# EAGLE design RoboatCore (EAGLE 7.7.0)
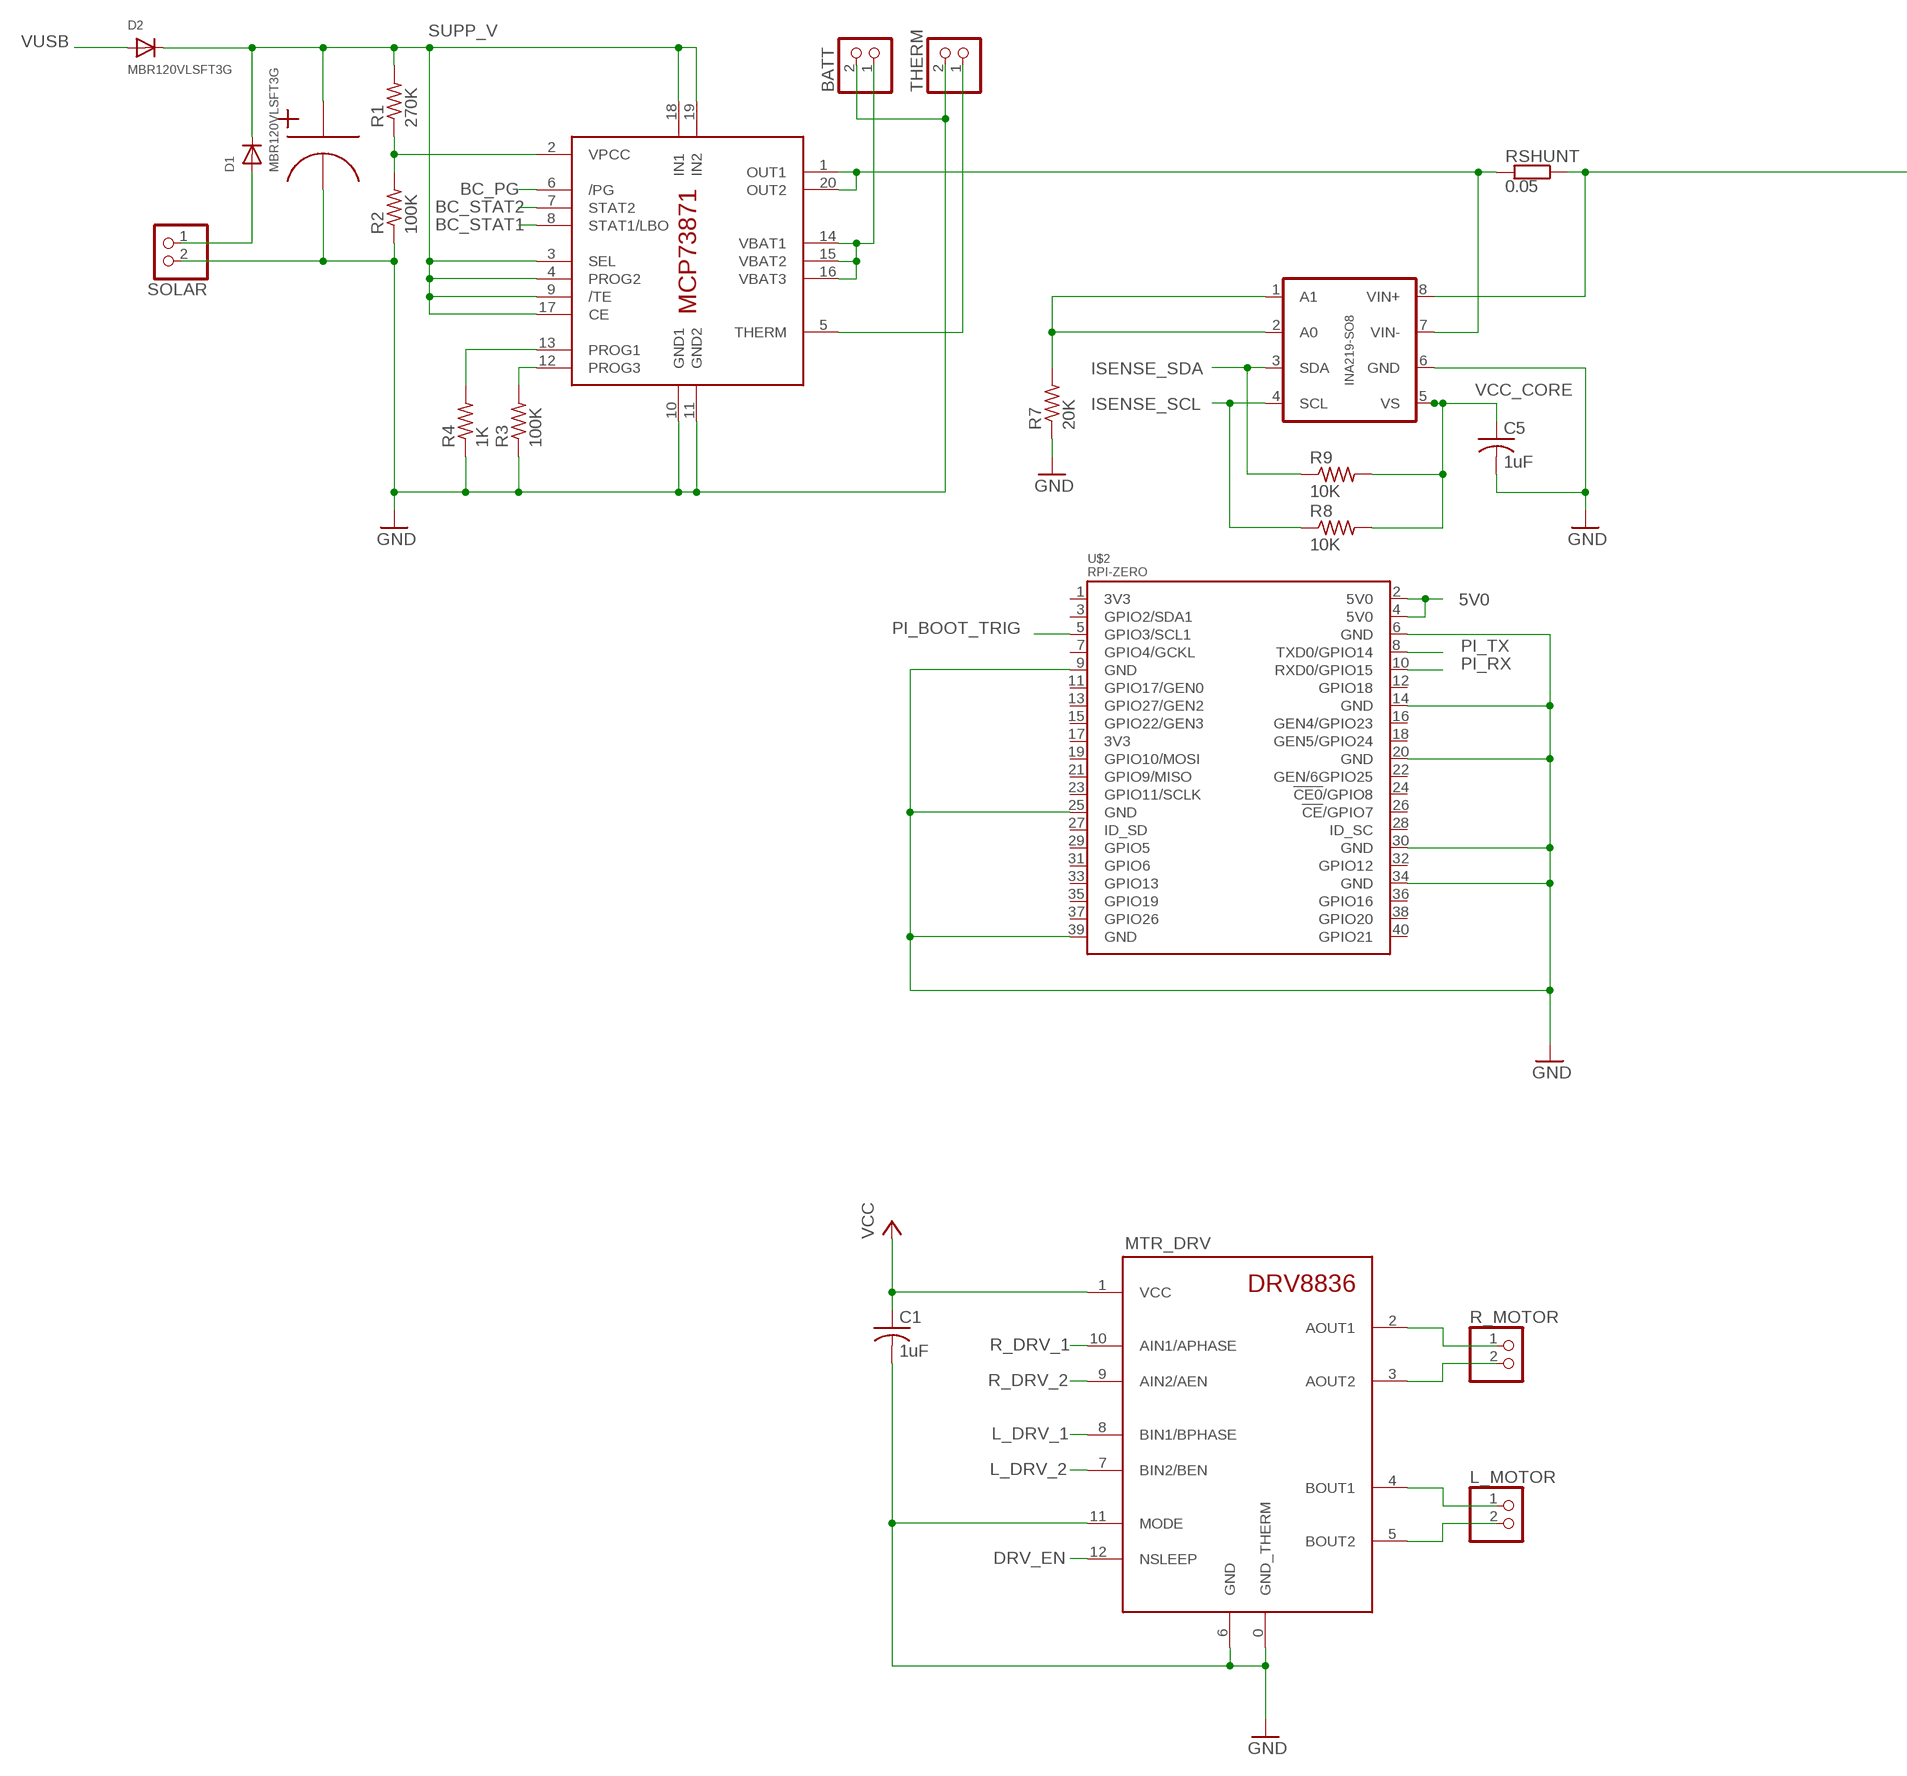
[diagram p0: schematic, sheet 1, part 1 of 2]
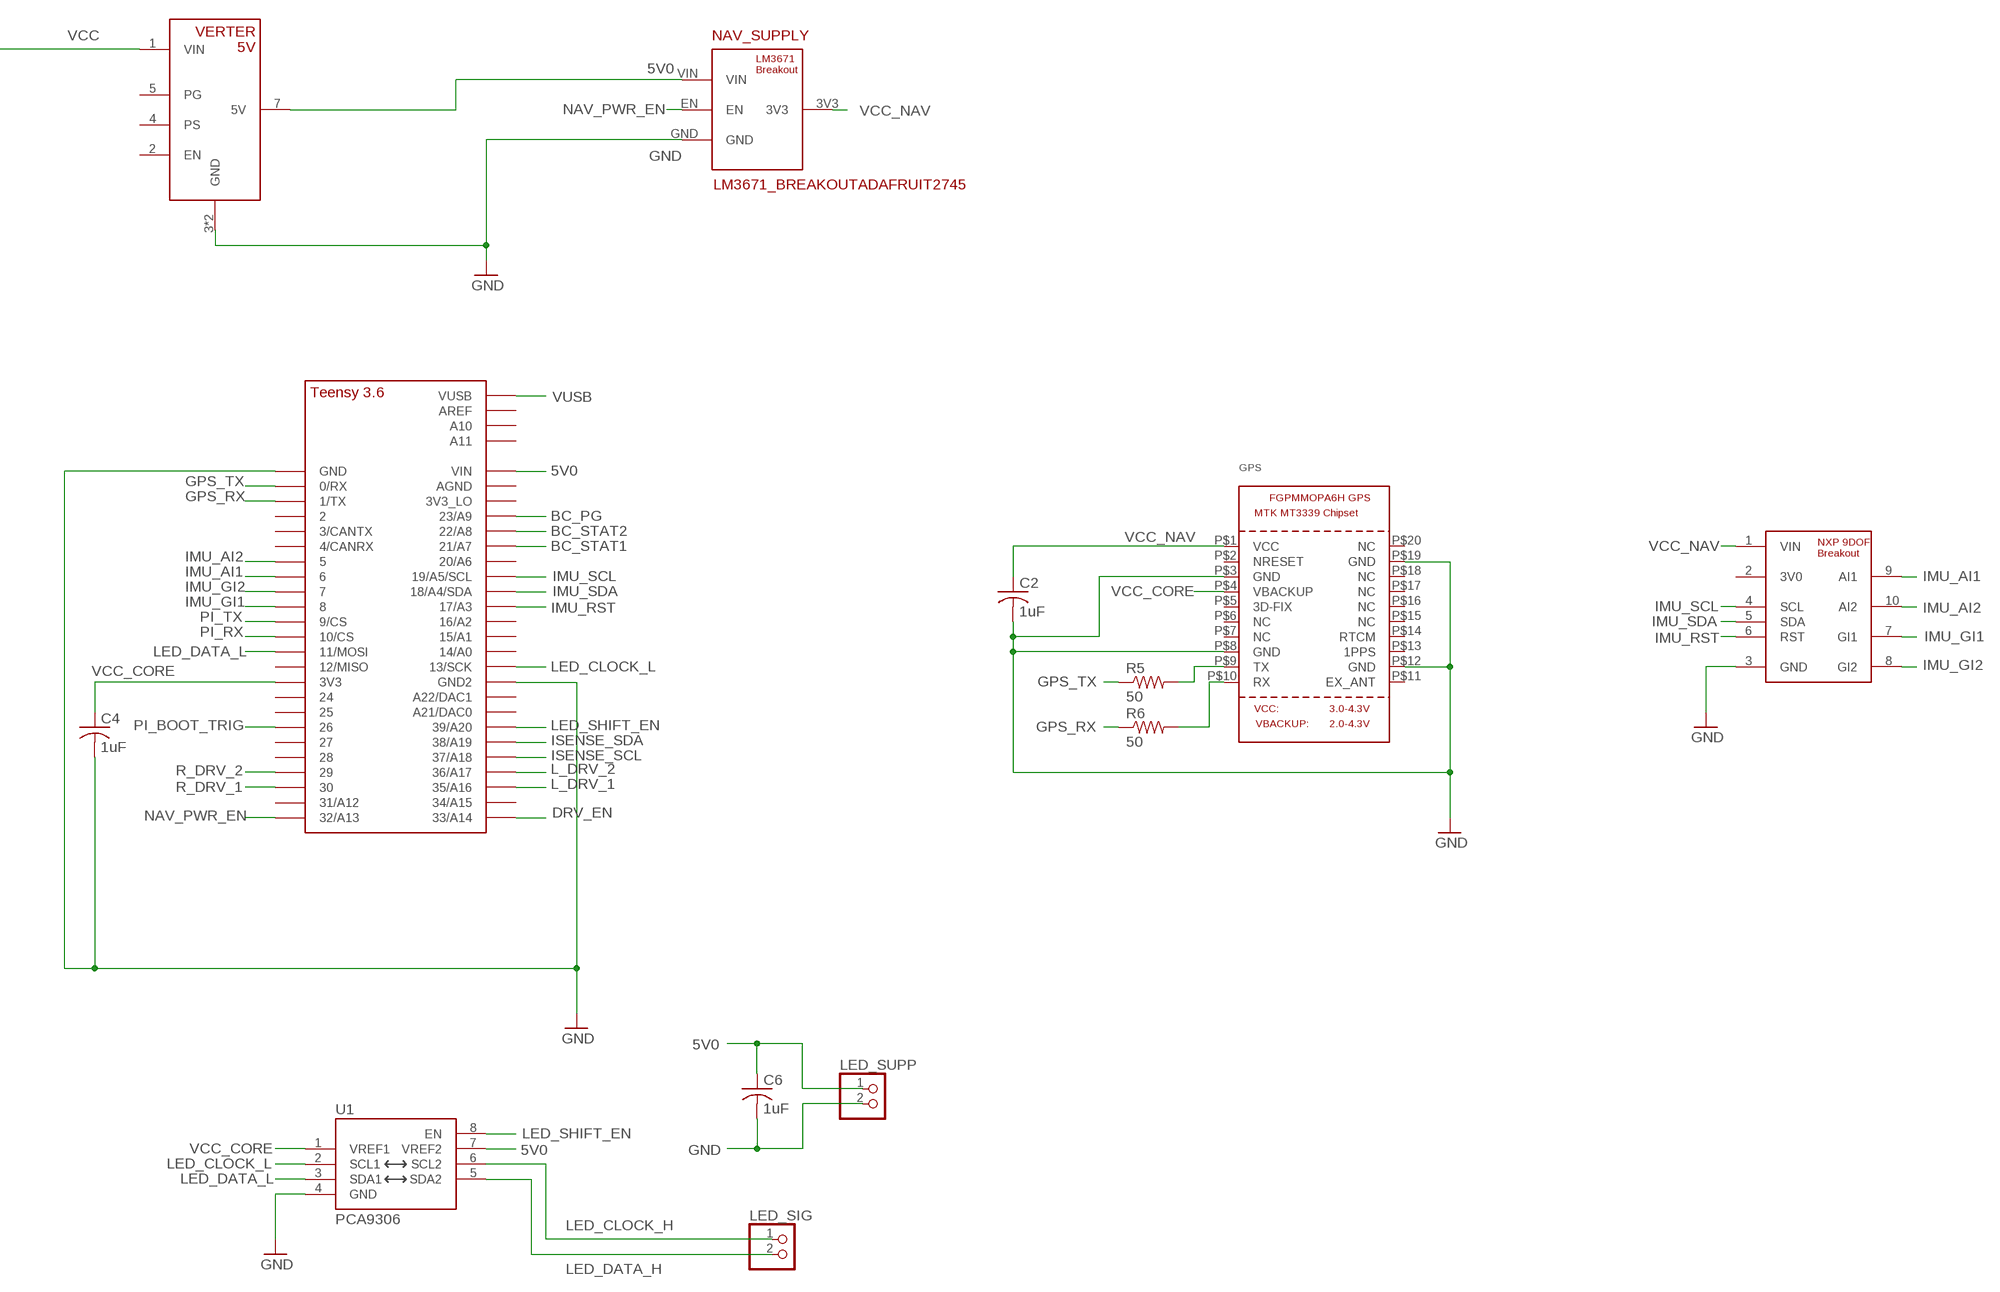
[diagram p1: schematic, sheet 1, part 2 of 2]

## Parts
BATT  JST_2PIN-SMT-RA  [JST-PH-2-SMT-RA]
C1  1uF  C-USC0603  [C0603]
C2  1uF  C-USC0603  [C0603]
C3  2200uF  2200UF_ELECTROLYTIC_CAP2200UF  [2200UF_CAN]
C4  1uF  C-USC0603  [C0603]
C5  1uF  C-USC0603  [C0603]
C6  1uF  C-USC0603  [C0603]
D1  MBR120VLSFT3G  DIODESOD-123  [SOD-123]
D2  MBR120VLSFT3G  DIODESOD-123  [SOD-123]
GPS  GPS_FGPMMOPA6H  [FGPMMOPA6H]
IC2  MCP73871  [QFN20]
INA219  INA219-SO8D  [SO08]
L_MOTOR  PINHD-1X2  [1X02]
LED_SIG  PINHD-1X2  [1X02]
LED_SUPP  PINHD-1X2  [1X02]
MTR_DRV  DRV8836DRV8836DSSR  [WSON-12]
NAV_SUPPLY  LM3671_BREAKOUTADAFRUIT2745  [LM3671_BREAKOUT]
R1  270K  R-US_R0603  [R0603]
R2  100K  R-US_R0603  [R0603]
R3  100K  R-US_R0603  [R0603]
R4  1K  R-US_R0603  [R0603]
R5  50  R-US_R0603  [R0603]
R6  50  R-US_R0603  [R0603]
R7  20K  R-US_R0603  [R0603]
R8  10K  R-US_R0603  [R0603]
R9  10K  R-US_R0603  [R0603]
R_MOTOR  PINHD-1X2  [1X02]
RSHUNT  0.05  SMK  [SMK]
SOLAR  JST_2PIN-SMT-RA  [JST-PH-2-SMT-RA]
THERM  JST_2PIN-SMT-RA  [JST-PH-2-SMT-RA]
U1  PCA9306  [PSOP-8]
U$1  TEENSY_3.5/3.6_BASIC  [TEENSY_3.5/3.6_BASIC]
U$2  RPI-ZERO  [RASP_PI_ZERO_BOARD_FULL]
U$3  NXP_9DOF_BREAKOUTADAFRUIT3463  [NXP_9DOF_BREAKOUT]
U$4  VERTER_5VADAFRUIT2190  [VERTER_5V]

## Nets
5V0: C6.1 LED_SUPP.1 NAV_SUPPLY.VIN U1.7(VREF2) U$1.VIN U$2.2(5V0) U$2.4(5V0) U$4.7(5V)
BATT_NTC: IC2.5(THERM) THERM.1
BC_PG: IC2.6(/PG) U$1.23/A9
BC_STAT1: IC2.8(STAT1/LBO) U$1.21/A7
BC_STAT2: IC2.7(STAT2) U$1.22/A8
DRV_EN: MTR_DRV.12(NSLEEP) U$1.33/A14
GND: BATT.2 C1.2 C2.2 C3.2(NEG) C4.2 C5.2 C6.2 GPS.P$3(GND) GPS.P$8(GND) GPS.P$12(GND) GPS.P$19(GND) IC2.10(GND1) IC2.11(GND2) INA219.6(GND) LED_SUPP.2 MTR_DRV.0(GND_THERM) MTR_DRV.6(GND) MTR_DRV.11(MODE) NAV_SUPPLY.GND R2.1 R3.1 R4.1 R7.1 SOLAR.2 THERM.2 U1.4(GND) U$1.GND U$1.GND2 U$2.6(GND) U$2.9(GND) U$2.14(GND) U$2.20(GND) U$2.25(GND) U$2.30(GND) U$2.34(GND) U$2.39(GND) U$3.3(GND) U$4.3(GND) U$4.6(GND)
GPS_RX: R6.1 U$1.1/TX
GPS_RX_I: GPS.P$10(RX) R6.2
GPS_TX: R5.1 U$1.0/RX
GPS_TX_O: GPS.P$9(TX) R5.2
IMU_AI1: U$1.6 U$3.9(AI1)
IMU_AI2: U$1.5 U$3.10(AI2)
IMU_GI1: U$1.8 U$3.7(GI1)
IMU_GI2: U$1.7 U$3.8(GI2)
IMU_RST: U$1.17/A3 U$3.6(RST)
IMU_SCL: U$1.19/A5/SCL U$3.4(SCL)
IMU_SDA: U$1.18/A4/SDA U$3.5(SDA)
ISENSE_SCL: INA219.4(SCL) R8.1 U$1.37/A18
ISENSE_SDA: INA219.3(SDA) R9.1 U$1.38/A19
L_DRV_1: MTR_DRV.8(BIN1/BPHASE) U$1.35/A16
L_DRV_2: MTR_DRV.7(BIN2/BEN) U$1.36/A17
LED_CLOCK_H: LED_SIG.1 U1.6(SCL2)
LED_CLOCK_L: U1.2(SCL1) U$1.13/SCK
LED_DATA_H: LED_SIG.2 U1.5(SDA2)
LED_DATA_L: U1.3(SDA1) U$1.11/MOSI
LED_SHIFT_EN: U1.8(EN) U$1.39/A20
N$1: MTR_DRV.2(AOUT1) R_MOTOR.1
N$2: MTR_DRV.3(AOUT2) R_MOTOR.2
N$3: IC2.2(VPCC) R1.1 R2.2
N$4: L_MOTOR.1 MTR_DRV.4(BOUT1)
N$5: L_MOTOR.2 MTR_DRV.5(BOUT2)
N$6: INA219.1(A1) INA219.2(A0) R7.2
N$7: BATT.1 IC2.14(VBAT1) IC2.15(VBAT2) IC2.16(VBAT3)
N$10: IC2.12(PROG3) R3.2
N$11: IC2.13(PROG1) R4.2
NAV_PWR_EN: NAV_SUPPLY.EN U$1.32/A13
PI_BOOT_TRIG: U$1.26 U$2.5(GPIO3/SCL1)
PI_RX: U$1.10/CS U$2.10(RXD0/GPIO15)
PI_TX: U$1.9/CS U$2.8(TXD0/GPIO14)
R_DRV_1: MTR_DRV.10(AIN1/APHASE) U$1.30
R_DRV_2: MTR_DRV.9(AIN2/AEN) U$1.29
SOLAR_V_RAW: D1.A SOLAR.1
SUPP_V: C3.1(POS) D1.C D2.C IC2.3(SEL) IC2.4(PROG2) IC2.9(/TE) IC2.17(CE) IC2.18(IN1) IC2.19(IN2) R1.2
VBUS: IC2.1(OUT1) IC2.20(OUT2) INA219.7(VIN-) RSHUNT.2
VCC: C1.1 INA219.8(VIN+) MTR_DRV.1(VCC) RSHUNT.1 U$4.1(VIN)
VCC_CORE: C4.1 C5.1 GPS.P$4(VBACKUP) INA219.5(VS) R8.2 R9.2 U1.1(VREF1) U$1.3V3
VCC_NAV: C2.1 GPS.P$1(VCC) NAV_SUPPLY.3V3 U$3.1(VIN)
VUSB: D2.A U$1.VUSB
Unconnected: GPS.P$2(NRESET) GPS.P$5(3D-FIX) GPS.P$6(NC) GPS.P$7(NC) GPS.P$11(EX_ANT) GPS.P$13(1PPS) GPS.P$14(RTCM) GPS.P$15(NC) GPS.P$16(NC) GPS.P$17(NC) GPS.P$18(NC) GPS.P$20(NC) U$1.2 U$1.3/CANTX U$1.3V3_LO U$1.4/CANRX U$1.12/MISO U$1.14/A0 U$1.15/A1 U$1.16/A2 U$1.20/A6 U$1.21/DAC0(A21/DAC0) U$1.24 U$1.25 U$1.27 U$1.28 U$1.31/A12 U$1.34/A15 U$1.A10 U$1.A11 U$1.A22/DAC1 U$1.AGND U$1.AREF U$2.1(3V3) U$2.3(GPIO2/SDA1) U$2.7(GPIO4/GCKL) U$2.11(GPIO17/GEN0) U$2.12(GPIO18) U$2.13(GPIO27/GEN2) U$2.15(GPIO22/GEN3) U$2.16(GEN4/GPIO23) U$2.17(3V3) U$2.18(GEN5/GPIO24) U$2.19(GPIO10/MOSI) U$2.21(GPIO9/MISO) U$2.22(GEN/6GPIO25) U$2.23(GPIO11/SCLK) U$2.24(!CE0!/GPIO8) U$2.26(!CE!/GPIO7) U$2.27(ID_SD) U$2.28(ID_SC) U$2.29(GPIO5) U$2.31(GPIO6) U$2.32(GPIO12) U$2.33(GPIO13) U$2.35(GPIO19) U$2.36(GPIO16) U$2.37(GPIO26) U$2.38(GPIO20) U$2.40(GPIO21) U$3.2(3V0) U$4.2(EN) U$4.4(PS) U$4.5(PG)

## Library data of the parts
BATT SOLAR THERM = adafruit:JST_2PIN: JST 2-Pin Connectors of various flavors SMT-RA (S2B-PH-SM4) 4UConnector #17311 SMT (B2B-PH-SM4) THM-RA (S2B-PH) THM (B2B-PH)
C1 C2 C4-C6 = adafruit:C-US: CAPACITOR, American symbol
C3 = Roboat:2200UF_ELECTROLYTIC_CAP
D1 D2 = adafruit:DIODE: Diode SMADIODE - SMA Surface Mount Package 20V 1A Schottky Diode Digikey: 641-1014-6-ND DO-1N4148 - Through Hole Small Current Diode SOD-123 20V 1 A (.5mV Vf) Schottky Diode - Digikey: MBRX120TPMSCT-ND SOD-323 10V 570mA (.38mV Vf, 3ns) Schottky Diode - Digikey: ZLLS410CT-ND SOD-523 30V 30mA Schottky Diode (RB751S-40TE61) - Digikey: RB751S-40TE61CT-ND SOT23-R/W - SOT23 Package (R = Solder Paste/Reflow Ovens, W = Hand-Soldering) BAT54Film 40V 300mA - Digikey: 497-7162-1-ND
GPS = adafruit:GPS_FGPMMOPA6H: GPS Module - MTK MT3339 Chipset, -165dBm sensitivity, 22 channels, 10Hz, auto-select external antenna options
IC2 = adafruit:MCP73871
INA219 = INA219 :INA219-SO8: INA219 Bi-Directional CURRENT/POWER MONITOR with I2C™ Interface http://www.ti.com/lit/ds/symlink/ina219.pdf
L_MOTOR LED_SIG LED_SUPP R_MOTOR = pinhead:PINHD-1X2: PIN HEADER
MTR_DRV = Roboat:DRV8836
NAV_SUPPLY = Roboat:LM3671_BREAKOUT
R1-R9 = adafruit:R-US_: RESISTOR, American symbol
RSHUNT = resistor-shunt:SMK: SMD SHUNT RESISTOR; OC_FARNELL: unknown; OC_NEWARK: unknown
U1 = SparkFun-IC-Comms:PCA9306: Bidirectional I2C level shifter Not compatible with all available part number pinout schemes- DOUBLE CHECK!!! Datasheet <https://cdn.sparkfun.com/datasheets/BreakoutBoards/PCA9306DC.pdf> SparkFun Products SparkFun Inventor's Kit for RedBot <https://www.sparkfun.com/products/12649> (ROB-12649) SparkFun RedBot Basic Kit <https://www.sparkfun.com/products/13166> (ROB-13166) SparkFun Level Translator Breakout - PCA9306 <https://www.sparkfun.com/products/11955> (BOB-11955) SparkFun Block for Intel Edison - ADC <https://www.sparkfun.com/products/13770> (DEV-13770) SparkFun Block for Intel® Edison - Raspberry Pi B <https://www.sparkfun.com/products/13044> (DEV-13044) SparkFun RedBot Sensor - Accelerometer <https://www.sparkfun.com/products/12589> (SEN-12589); PROD_ID: IC-10023
U$1 = Teensy356:TEENSY_3.5/3.6_BASIC
U$2 = rpi-zero:RPI-ZERO
U$3 = Roboat:NXP_9DOF_BREAKOUT
U$4 = Roboat:VERTER_5V

## Board
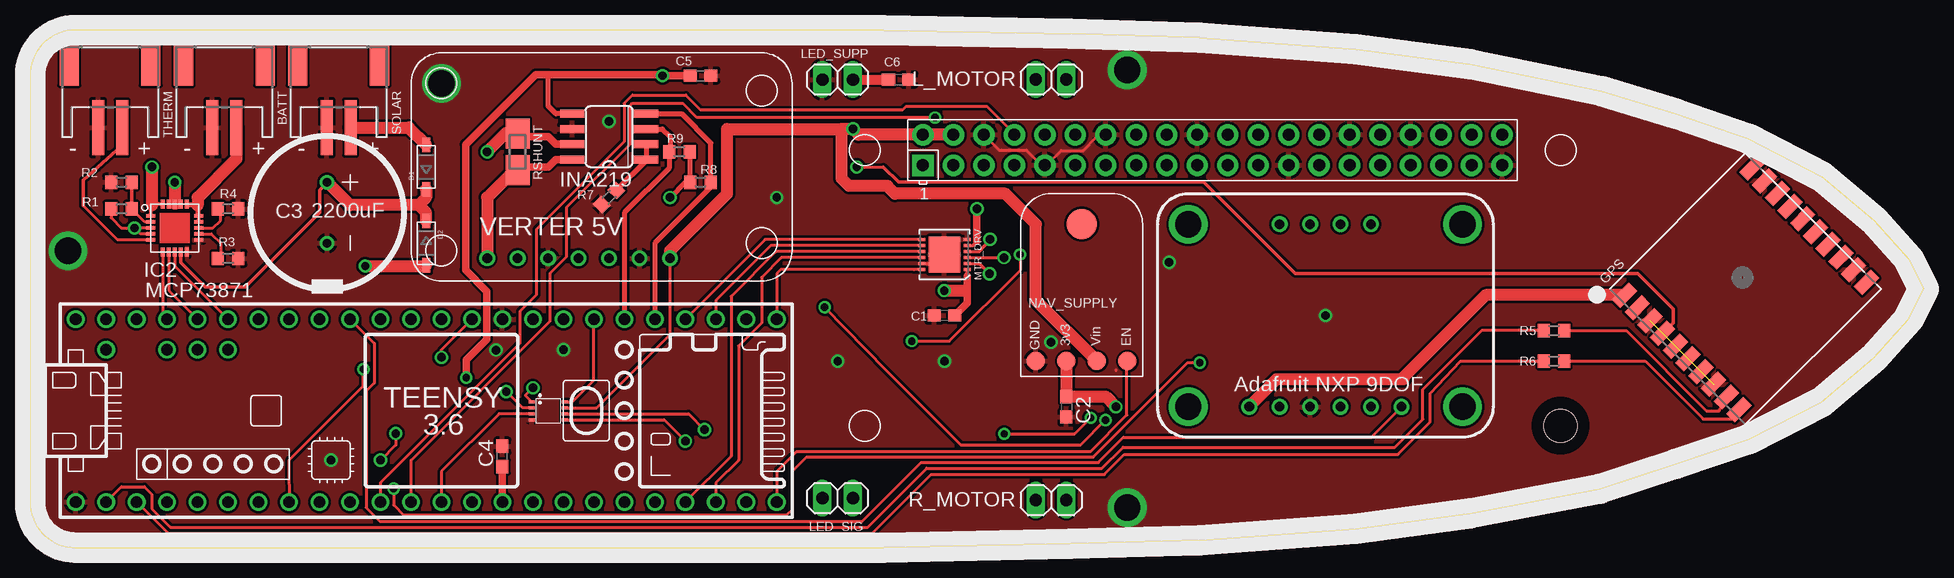
[diagram p2: board, top side]
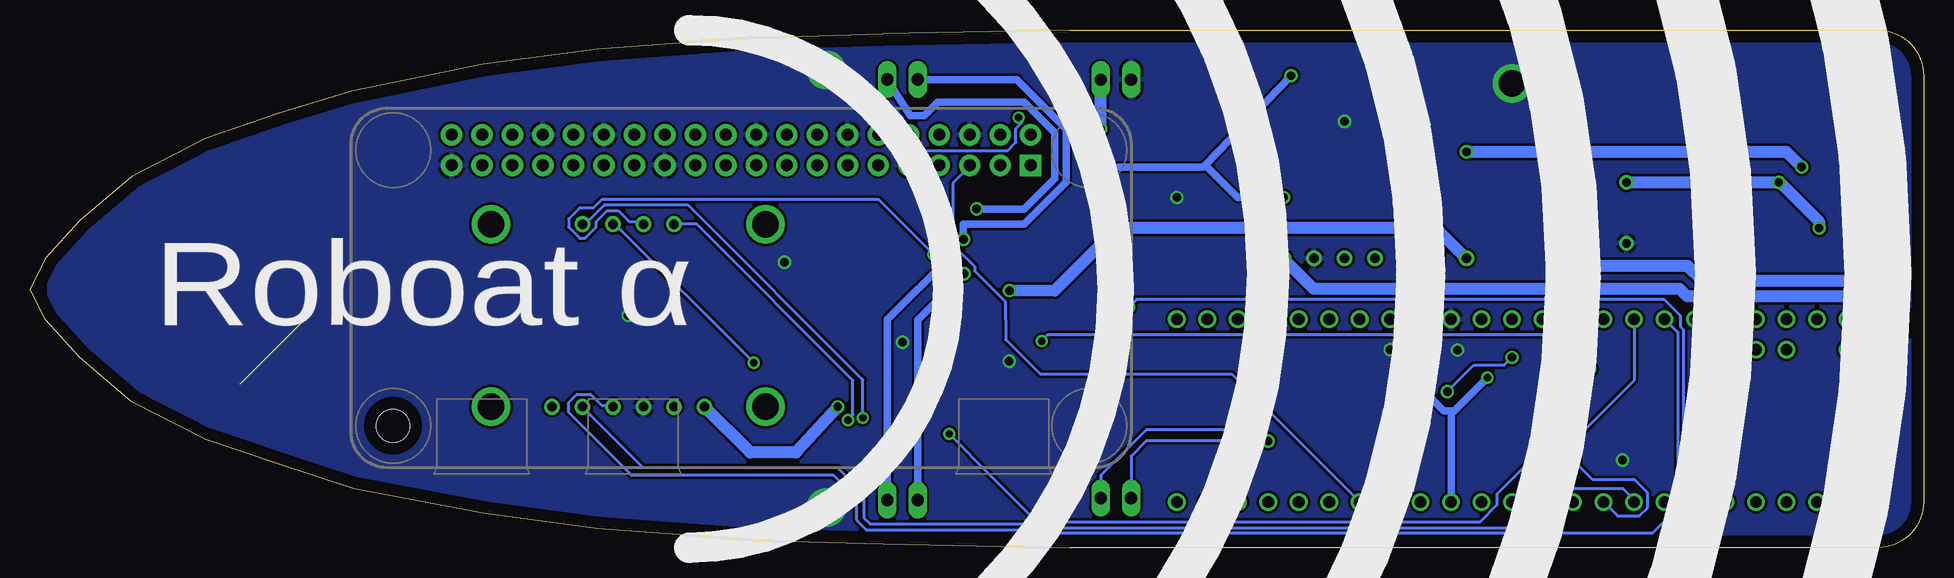
[diagram p3: board, bottom side, seen from below]

Size 157.8 x 43.18 mm. Coordinates in mm from the lower left corner, seen from the top.
Outline: 71.12,43.18 3.81,43.18 arc90 0,39.37 0,3.81 arc90 3.81,0 71.12,0 86.68,0.32 97.47,0.64 110.49,1.59 120.02,2.86 130.81,4.92 137.16,6.99 143.19,9.05 149.3,12.14 153.67,15.88 156.53,19.05 157.8,21.59 156.53,24.13 153.67,27.3 149.3,30.96 143.19,34.13 137.16,36.2 130.97,38.08 120.02,40.32 110.49,41.59 97.47,42.55 86.68,42.86 71.12,43.18
Copper layers (1*16): Top 0.035mm / dielectric 1.5mm / Bottom 0.035mm
Design rules "default": minimum track width 10mil, minimum drill 24mil, track to track 8mil, track to pad 8mil, pad to pad 8mil, via to via 8mil, smd to smd 8mil, copper to edge 40mil, drill to drill 8mil, minimum pad ring 10mil, minimum via ring 8mil, stop-mask expansion 4mil, vias tented up to drill 0mil, thermal gap 10mil

### Footprints (pad centres in the part's own frame; a part is rotated, then mirrored left to right if it is on the bottom)
JST-PH-2-SMT-RA = smd 1 x 4.6: 1 1,-3.7; 2 -1,-3.7 | smd 1.6 x 3.4: NC1 -3.4,1.5; NC2 3.4,1.5
C0603 = smd 1.1 x 1: 1 -0.85,0; 2 0.85,0
2200UF_CAN = drill 0.7: 1 0,0; 2 5.08,0
SOD-123 = smd 1.2 x 0.7: A 1.85,0; C -1.85,0
FGPMMOPA6H = smd 2 x 1: P$1 -7.5,6.75; P$2 -7.5,5.25; P$3 -7.5,3.75; P$4 -7.5,2.25; P$5 -7.5,0.75; P$6 -7.5,-0.75; P$7 -7.5,-2.25; P$8 -7.5,-3.75; P$9 -7.5,-5.25; P$10 -7.5,-6.75; P$11 7.5,-6.75; P$12 7.5,-5.25; P$13 7.5,-3.75; P$14 7.5,-2.25; P$15 7.5,-0.75; P$16 7.5,0.75; P$17 7.5,2.25; P$18 7.5,3.75; P$19 7.5,5.25; P$20 7.5,6.75
QFN20 = smd 0.75 x 0.3: 1 -2,1; 2 -2,0.5; 3 -2,0; 4 -2,-0.5; 5 -2,-1; 11 2,-1; 12 2,-0.5; 13 2,0; 14 2,0.5; 15 2,1 | smd 0.3 x 0.75: 6 -1,-2; 7 -0.5,-2; 8 0,-2; 9 0.5,-2; 10 1,-2; 16 1,2; 17 0.5,2; 18 0,2; 19 -0.5,2; 20 -1,2
SO08 = smd 2.032 x 0.66: 1 -3.073,1.905; 2 -3.073,0.635; 3 -3.073,-0.635; 4 -3.073,-1.905; 5 3.073,-1.905; 6 3.073,-0.635; 7 3.073,0.635; 8 3.073,1.905
1X02 = drill 1.016 long: 1 -1.27,0; 2 1.27,0
WSON-12 = smd 3 x 2.6: 0 0,0 | smd 0.25 x 0.6: 1 1.25,1.9; 2 0.75,1.9; 3 0.25,1.9; 4 -0.25,1.9; 5 -0.75,1.9; 6 -1.25,1.9; 7 -1.25,-1.9; 8 -0.75,-1.9; 9 -0.25,-1.9; 10 0.25,-1.9; 11 0.75,-1.9; 12 1.25,-1.9
LM3671_BREAKOUT = smd 1.524 x 1.524: 3V3 3.81,1.27; EN 8.89,1.27; GND 1.27,1.27; VIN 6.35,1.27 | smd 2.54 x 2.54: P$1 5.08,12.7
R0603 = smd 1 x 1.1: 1 -0.85,0; 2 0.85,0
SMK = smd 2.5 x 2: 1 1.524,0; 2 -1.524,0
PSOP-8 = smd 0.25 x 0.5: 1 -0.73,-1.37; 2 -0.23,-1.37; 3 0.27,-1.37; 4 0.77,-1.37; 5 0.77,1.38; 6 0.27,1.38; 7 -0.23,1.38; 8 -0.73,1.38
TEENSY_3.5/3.6_BASIC = drill 0.965: 0/RX -25.4,-7.62; 1/TX -22.86,-7.62; 2 -20.32,-7.62; 3/CANTX -17.78,-7.62; 3V3 7.62,-7.62; 3V3_LO -22.86,7.62; 4/CANRX -15.24,-7.62; 5 -12.7,-7.62; 6 -10.16,-7.62; 7 -7.62,-7.62; 8 -5.08,-7.62; 9/CS -2.54,-7.62; 10/CS 0,-7.62; 11/MOSI 2.54,-7.62; 12/MISO 5.08,-7.62; 13/SCK 5.08,7.62; 14/A0 2.54,7.62; 15/A1 0,7.62; 16/A2 -2.54,7.62; 17/A3 -5.08,7.62; 18/A4/SDA -7.62,7.62; 19/A5/SCL -10.16,7.62; 20/A6 -12.7,7.62; 21/A7 -15.24,7.62; 21/DAC0 12.7,7.62; 22/A8 -17.78,7.62; 23/A9 -20.32,7.62; 24 10.16,-7.62; 25 12.7,-7.62; 26 15.24,-7.62; 27 17.78,-7.62; 28 20.32,-7.62; 29 22.86,-7.62; 30 25.4,-7.62; 31/A12 27.94,-7.62; 32/A13 30.48,-7.62; 33/A14 30.48,7.62; 34/A15 27.94,7.62; 35/A16 25.4,7.62; 36/A17 22.86,7.62; 37/A18 20.32,7.62; 38/A19 17.78,7.62; 39/A20 15.24,7.62; A10 -17.78,5.08; A11 -15.24,5.08; A22/DAC1 10.16,7.62; AGND -25.4,7.62; AREF -20.32,5.08; GND -27.94,-7.62; GND2 7.62,7.62; VIN -27.94,7.62; VUSB -25.4,5.08
RASP_PI_ZERO_BOARD_FULL = drill 1 pad 1.778 square: 1 8.37,25.23 | drill 1 pad 1.778: 2 8.37,27.77; 3 10.91,25.23; 4 10.91,27.77; 5 13.45,25.23; 6 13.45,27.77; 7 15.99,25.23; 8 15.99,27.77; 9 18.53,25.23; 10 18.53,27.77; 11 21.07,25.23; 12 21.07,27.77; 13 23.61,25.23; 14 23.61,27.77; 15 26.15,25.23; 16 26.15,27.77; 17 28.69,25.23; 18 28.69,27.77; 19 31.23,25.23; 20 31.23,27.77; 21 33.77,25.23; 22 33.77,27.77; 23 36.31,25.23; 24 36.31,27.77; 25 38.85,25.23; 26 38.85,27.77; 27 41.39,25.23; 28 41.39,27.77; 29 43.93,25.23; 30 43.93,27.77; 31 46.47,25.23; 32 46.47,27.77; 33 49.01,25.23; 34 49.01,27.77; 35 51.55,25.23; 36 51.55,27.77; 37 54.09,25.23; 38 54.09,27.77; 39 56.63,25.23; 40 56.63,27.77 | hole 2.75: 61.5,3.5
NXP_9DOF_BREAKOUT = drill 0.8: 1 -6.35,-7.62; 2 -3.81,-7.62; 3 -1.27,-7.62; 4 1.27,-7.62; 5 3.81,-7.62; 6 6.35,-7.62; 7 3.81,7.62; 8 1.27,7.62; 9 -1.27,7.62; 10 -3.81,7.62 | drill 2.2: P$11 -11.43,7.62; P$12 11.43,-7.62; P$13 11.43,7.62; P$14 -11.43,-7.62
VERTER_5V = drill 0.8: 1 6.35,1.27; 2 8.89,1.27; 3 11.43,1.27; 4 13.97,1.27; 5 16.51,1.27; 6 19.05,1.27; 7 21.59,1.27

### Placement (x,y rotation side)
BATT  16.19,38.73 0 top
C1  76.2,19.37 180 top
C2  86.36,11.75 270 top
C3  24.77,30.48 270 top
C4  39.37,7.62 90 top
C5  55.88,39.37 0 top
C6  72.39,39.05 0 top
D1  33.02,31.75 90 top
D2  33.02,25.4 270 top
GPS  142.95,21.59 45 top
IC2  12.07,26.67 0 top
INA219  48.26,34.29 180 top
L_MOTOR  85.09,39.05 0 top
LED_SIG  67.31,4.13 180 top
LED_SUPP  67.31,39.05 180 top
MTR_DRV  76.2,24.45 270 top
NAV_SUPPLY  82.55,14.29 0 top
R1  7.62,28.26 180 top
R2  7.62,30.48 0 top
R3  16.51,24.13 180 top
R4  16.51,28.26 180 top
R5  127,18.1 0 top
R6  127,15.56 0 top
R7  48.26,29.21 45 top
R8  55.88,30.48 180 top
R9  54.12,33.02 0 top
R_MOTOR  85.09,3.97 0 top
RSHUNT  40.64,33.02 270 top
SOLAR  25.72,38.73 0 top
THERM  6.67,38.73 0 top
U1  43.18,11.43 270 top
U$1  31.75,11.43 0 top
U$2  66.04,6.67 0 top
U$3  107.95,19.37 0 top
U$4  31.75,22.86 0 top

### Tracks (layer width: path | path; a pad name or v marks a point on that pad's centre or on a via)
5V0  (via drill 0.7)
  Top 0.254: U1.7 47.22,11.66 53.34,17.78 U$4.7
  Top 0.813: LED_SUPP.1 C6.1
  Top 1.016: NAV_SUPPLY.VIN 83.82,20.64 83.82,26.99 81.28,29.53 72.07,29.53 71.44,30.16 68.26,30.16 67.63,30.8 67.63,34.92 | U$2.4 U$2.2 69.05,34.44 v68.58,34.92 67.63,34.92 | U$4.7 53.34,24.77 58.1,29.53 58.1,34.92 67.63,34.92
  Bottom 1.016: v68.58,34.92 LED_SUPP.1 | U$4.7 50.8,21.59 20.32,21.59 19.68,20.95 5.08,20.95 3.81,19.68 U$1.VIN
BATT_NTC
  Top 0.254: IC2.5 7.31,25.67 4.45,28.53
  Top 0.305: THERM.1 7.62,33.5 4.45,30.64 4.45,28.53
BC_PG
  Top 0.254: IC2.6 11.07,19.41 U$1.23/A9
BC_STAT1
  Top 0.254: IC2.8 12.07,23.5 U$1.21/A7
BC_STAT2
  Top 0.254: IC2.7 11.57,21.45 U$1.22/A8
DRV_EN
  Top 0.254: MTR_DRV.12 73.68,23.19 62.56,23.19 62.23,22.86 U$1.33/A14
GND  (via drill 0.7, 2.2)  (1 unrouted)
  Top 0.254: MTR_DRV.11 75.46,23.71 | U$2.14 89.59,34.28 88.9,34.28 87.76,33.13 85.93,33.13 84.79,31.99 U$2.9 arc-45 84.12,32.08 83.08,33.13 80.8,33.13 U$2.6 | 90.5,14.85 90.49,14.77
  Top 0.305: 75.46,23.71 MTR_DRV.0
  Bottom 0.254: 15.9,7.34 15.89,7.29 | 79.53,34.51 U$2.6
  other vias: 107.95,19.37 25.08,7.3 94.93,23.81 38.83,16.48 44.45,16.51 85.09,17.14 76.2,15.56 67.31,15.56 48.26,35.56 91.44,3.33 91.44,39.85 3.18,24.77 34.29,38.73 62.23,29.21
  pour Bottom: -1.27,43.81 156.21,43.18 156.21,0 -1.27,0
  pour Top: -1.27,43.81 156.21,43.81 156.21,0 -1.27,0
GPS_RX
  Top 0.254: U$1.1/TX 11.51,1.19 70.17,1.19 75.09,6.12 89.54,6.12 91.2,7.78 113.98,7.78 116.68,10.48 116.68,12.86 119.22,15.56 R6.1
GPS_RX_I
  Top 0.254: 142.96,11.51 GPS.P$10 142.2,10.73 139.42,10.73 134.59,15.56 R6.2
GPS_TX
  Top 0.254: U$1.0/RX 7.62,5.08 9.53,5.08 10.16,4.45 10.16,3.25 11.69,1.71 69.82,1.71 74.73,6.62 89.32,6.62 91.08,8.38 113.75,8.38 116.08,10.72 116.08,13.21 120.97,18.1 R5.1
GPS_TX_O
  Top 0.254: GPS.P$9 140.77,11.43 139.7,11.43 133.03,18.1 R5.2
IMU_AI1  (via drill 0.61)
  Top 0.254: v27.79,14.88 27.79,13.51 21.62,7.34 21.62,5.28 U$1.6 | v73.48,17.23 76.61,17.23 82.55,23.18 82.55,24.4 v82.5,24.45
  Bottom 0.254: v82.5,24.45 87.07,29.02 110.16,29.02 110.85,28.33 111.99,28.33 112.9,27.42 112.9,26.73 111.99,25.82 111.53,25.82 110.62,26.73 110.62,27.19 109.7,28.11 108.79,28.11 107.87,27.19 106.73,27.19 U$3.9 | v27.79,14.88 30.63,17.73 73.03,17.73 v73.48,17.23
IMU_AI2  (via drill 0.61)
  Top 0.254: v66.22,20.05 71.3,14.85 77.56,8.59 87.57,8.59 v89.62,10.64
  Bottom 0.254: v66.22,20.05 65.57,20.7 21.62,20.7 20.24,19.33 20.24,18.41 20,18.17 20,4.76 U$1.5 | U$3.10 102.23,26.99 89.22,13.97 89.22,11.11 89.62,10.71 v89.62,10.64
IMU_GI1  (via drill 0.61, 0.7)
  Top 0.254: v81.19,9.5 87.06,9.5 v88.39,10.83 | v30.48,9.53 30.48,8.57 v29.21,7.3
  Bottom 0.254: U$1.8 25.5,2.64 23.67,2.64 22.99,3.33 22.99,4.57 24.13,5.71 27.62,5.71 v29.21,7.3 | U$3.7 111.76,27.19 111.3,27.19 109.93,28.56 102.95,28.56 88.39,14.01 v88.39,10.83 | v81.19,9.5 77.7,5.94 74.4,2.64 72.31,2.64 71.85,2.18 36.94,2.18 36.94,2.17 35.56,3.56 35.56,4.47 34.16,5.87 34.14,5.87 v30.48,9.53
IMU_GI2  (via drill 0.61)
  Top 0.254: v97.48,15.43 96.47,15.43 88.61,7.57 64.72,7.57 63.5,6.35 63.5,3.17 63.02,2.7 31.16,2.7 30.3,3.56 v30.3,4.93
  Bottom 0.254: v97.48,15.43 109.02,26.96 U$3.8 | v30.3,4.93 25.04,4.93 24.13,4.01 U$1.7
IMU_RST
  Top 0.254: 114.28,11.65 U$3.6 111.76,9.21 91.12,9.21 89.03,7.11 74.27,7.11 69.34,2.18 29.16,2.18 28.02,3.33 28.02,13.06 28.7,13.74 28.7,17.04 26.87,18.87 U$1.17/A3
IMU_SCL
  Bottom 0.254: U$3.4 109.25,11.87 110.16,11.87 111.07,12.79 112.22,12.79 112.9,12.1 112.91,11.29 107.66,6.03 90.81,6.03 88.9,4.13 88.9,2.3 88.11,1.51 73.26,1.51 72.94,1.18 22.62,1.18 20.47,3.33 20.47,17.96 21.39,18.87 U$1.19/A5/SCL
IMU_SDA
  Bottom 0.254: U$1.18/A4/SDA 24.13,13.95 32.82,5.26 32.82,3.56 34.73,1.64 72.12,1.64 72.47,1.98 87.79,1.98 88.27,2.46 88.27,4.45 90.49,6.67 106.68,6.67 U$3.5 111.25,11.24
ISENSE_SCL
  Top 0.406: INA219.4 54.29,36.2 56.73,33.76 R8.1 56.73,30.06 52.07,25.4 U$1.37/A18
ISENSE_SDA
  Top 0.406: U$1.38/A19 49.53,27.94 53.27,31.68 R9.1 53.34,33.09 53.34,34.29 52.7,34.92 INA219.3
L_DRV_1
  Top 0.254: U$1.35/A16 57.15,20.64 61.71,25.2 MTR_DRV.8
L_DRV_2
  Top 0.254: MTR_DRV.7 74.25,25.7 61.26,25.7 U$1.36/A17 54.76,19.1
LED_CLOCK_H  (via drill 0.7)
  Top 0.254: U1.6 54.88,11.16 v56.2,9.84
  Bottom 0.254: v56.2,9.84 64.77,9.84 68.58,6.03 LED_SIG.1
LED_CLOCK_L  (via drill 0.7)
  Top 0.254: U1.2 41.04,11.66 v39.69,13.02 | v34.29,15.88 34.29,16.51 U$1.13/SCK
  Bottom 0.254: v39.69,13.02 37.46,15.24 34.92,15.24 v34.29,15.88
LED_DATA_H  (via drill 0.7)
  Top 0.254: U1.5 52.84,10.66 v54.61,8.89
  Bottom 0.254: v54.61,8.89 64.77,8.89 66.04,7.62 LED_SIG.2
LED_DATA_L
  Top 0.254: U1.3 39.1,11.16 34.29,6.35 U$1.11/MOSI
LED_SHIFT_EN
  Top 0.254: U1.8 45.18,12.16 46.99,13.97 U$1.39/A20
N$1  (via drill 0.7)
  Top 0.254: MTR_DRV.2 79.12,23.7
  Top 0.305: 79.12,23.7 v79.96,22.86
  Bottom 0.61: v79.96,22.86 83.82,18.98 R_MOTOR.1
N$2  (via drill 0.7)
  Top 0.254: MTR_DRV.3 v81.16,24.19
  Bottom 0.61: v81.16,24.19 86.36,19.03 R_MOTOR.2
N$3
  Top 0.254: IC2.2 9.57,27.17 8.74,28 8.74,28.31 R1.1
  Top 0.305: R2.2 R1.1
N$4  (via drill 0.7)
  Top 0.254: MTR_DRV.4 79.1,24.7
  Top 0.305: 79.1,24.7 v80.01,25.72
  Bottom 0.61: v80.01,25.72 80.01,26.99 74.93,26.99 71.44,30.48 71.44,34.92 75.56,39.05 L_MOTOR.1
N$5  (via drill 0.7)
  Top 0.254: MTR_DRV.5 78.55,25.2
  Top 0.305: 78.55,25.2 78.92,25.56
  Top 0.61: 78.92,25.56 v78.91,28.26
  Bottom 0.61: v78.91,28.26 74.93,28.26 72.39,30.8 72.39,34.61 74.93,37.15 81.99,37.16 82.15,37.16 83.26,36.04 84.45,36.04 L_MOTOR.2
N$6
  Top 0.254: INA219.1 51.33,32.28
  Top 0.406: INA219.2 INA219.1 | 51.33,32.28 R7.2
N$7
  Top 0.305: IC2.14 IC2.15 | 13.16,28.57 IC2.16
  Top 0.406: IC2.15 13.97,27.77 13.97,28.57 13.16,28.57
  Top 1.016: BATT.1 17.19,32.43 13.97,29.21 13.97,28.57
N$10
  Top 0.254: IC2.12 15.11,26.17 15.88,25.4 15.88,24.34 R3.2
N$11
  Top 0.254: IC2.13 15.24,26.67 15.88,27.3 15.88,28.36 R4.2
NAV_PWR_EN
  Top 0.254: NAV_SUPPLY.EN 91.42,15.53 91.42,11.06 88.38,8.03 63.91,8.03 62.23,6.35 U$1.32/A13
PI_BOOT_TRIG
  Bottom 0.254: U$2.5 79.53,31.76 80.9,30.39 80.9,25.26 79.07,23.45 79.07,23.08 76.53,20.54 76.5,17.36 73.61,14.49 57.67,14.49 U$1.26
PI_RX  (via drill 0.61)
  Top 0.254: v75.41,35.88 55.56,35.88 54.38,37.06 50.19,37.06 49.96,36.83 49.96,33.63 44.7,28.37 44.7,24.26 43.33,22.89 43.33,18.87 31.75,7.29 U$1.10/CS
  Bottom 0.254: v75.41,35.88 75.41,35.65 75.18,35.42 75.64,34.96 75.64,33.82 76.33,33.13 83.41,33.13 84.56,34.28 U$2.10
PI_TX
  Top 0.254: U$2.8 82.04,34.51 79.76,36.79 72.99,36.79 72.71,36.51 55.88,36.51 54.65,37.74 50.19,37.74 49.5,37.06 49.5,33.86 42.19,26.54 42.19,21.08 40.82,19.71 40.82,17.04 29.21,5.44 U$1.9/CS
R_DRV_1
  Top 0.254: MTR_DRV.10 74.26,24.2 62.61,24.2 60.96,22.54 60.96,18.73 59.05,16.83 59.05,7.3 57.15,5.4 U$1.30
R_DRV_2
  Top 0.254: U$1.29 58.42,7.62 58.42,20.95 62.16,24.7 MTR_DRV.9
SOLAR_V_RAW
  Top 1.016: SOLAR.1 31.58,35.03 D1.A
SUPP_V  (via drill 0.7)
  Top 0.254: IC2.3 9.05,26.67 v8.7,26.66 | 6.71,28.52 R1.2 6.77,27.52 7.62,26.67 v8.7,26.67 v8.7,26.66 | IC2.4 9.2,26.17 v8.7,26.66
  Top 0.305: IC2.17 IC2.18 IC2.19 | IC2.9 12.57,23.79 14.61,21.75 17.94,21.75 24.13,27.94 24.13,29.84 C3.1
  Top 1.016: 32.38,28.57 26.67,28.57 C3.1 | v12.07,30.48 IC2.18 | D2.C 33.02,27.94 32.38,28.57 | D1.C 33.02,29.21 32.38,28.57
  Bottom 1.016: C3.1 v12.07,30.48 11.99,30.48 8.7,27.19 v8.7,26.67 v8.7,26.66
VBUS  (via drill 0.7)
  Top 0.305: 39.69,34.61 RSHUNT.2 | IC2.20 10.7,28.67 10.16,29.21 | IC2.1 10.07,28.48 10.16,28.57
  Top 0.406: 40.89,34.29 RSHUNT.2
  Top 0.61: INA219.7 43.81,33.66 43.18,34.29 40.89,34.29
  Top 1.016: 40.39,34.29 RSHUNT.2 | v38.1,33.02 39.69,34.61 | v10.16,31.75 10.16,29.21 10.16,28.57
  Bottom 1.016: v38.1,33.02 11.43,33.02 v10.16,31.75
VCC  (via drill 0.7)
  Top 0.254: 41.05,31.75 41.05,31.8 RSHUNT.1
  Top 0.305: 78.11,22.66 MTR_DRV.1 | 77.88,21.44 78.1,21.9
  Top 0.406: 40.89,31.75 RSHUNT.1
  Top 0.61: INA219.8 43.81,32.38 43.18,31.75 41.05,31.75 40.64,31.75 | C1.1 78.09,20.41 78.1,21.9 78.11,22.66
  Top 1.016: RSHUNT.1 40.64,31.75 38.1,29.21 U$4.1 | v76.18,21.44 77.88,21.44
  Bottom 1.016: 68.11,25.74 68.52,25.34 | 68.52,25.34 72.43,21.43 v76.18,21.44 | U$4.1 40.64,26.67 67.18,26.67 68.52,25.34
VCC_CORE  (via drill 0.61, 0.7)
  Top 0.254: 133.98,22.86 133.98,22.85 | GPS.P$4 | U1.1 41.27,12.7 v41.91,13.34 | v68.9,31.75 71.12,31.75
  Top 0.305: GPS.P$4 136.92,18.73 136.92,19.92 133.98,22.86 105.44,22.86 99.81,28.49 97.82,30.48 72.39,30.48 71.12,31.75
  Top 0.406: INA219.5 43.81,36.2 43.18,36.83 43.18,39.47 | R9.2 54.97,30.54 R8.2 54.61,30.48 v53.34,29.21
  Top 0.61: U$1.3V3 C4.1 | v36.35,14.17 36.35,15.65 38.07,17.37 38.07,21.39 36.3,23.16 36.3,33.63 42.14,39.47 43.18,39.47 52.6,39.47 v52.7,39.37 C5.1
  Bottom 0.61: U$1.3V3 39.37,11.15 39.23,11.29 | 39.23,11.29 v36.35,14.17 | v41.91,13.34 40,11.43 39.37,11.43 39.23,11.29 | 59.85,31.91 60.01,31.75 v68.9,31.75 | 59.85,31.91 v52.7,39.37 | v53.34,29.21 57.15,29.21 59.85,31.91
VCC_NAV  (via drill 0.7)
  Top 0.254: 101.7,11.87 U$3.1
  Top 1.016: NAV_SUPPLY.3V3 C2.1 89.64,12.6 v90.49,11.75 | 114.3,14.06 103.89,14.06 101.7,11.87 | 114.3,14.06 114.45,14.06 | 114.3,14.06 121.3,21.06 GPS.P$1
  Bottom 1.016: v90.49,11.75 93.98,7.94 97.79,7.94 U$3.1
VUSB  (via drill 0.7)
  Top 1.016: v27.94,23.5 32.96,23.5 D2.A
  Bottom 1.016: U$1.VUSB 3.18,16.51 1.9,17.78 1.9,19.68 4.45,22.23 18.41,22.23 19.68,23.5 v27.94,23.5

### Text on the board
bNames: Roboat α